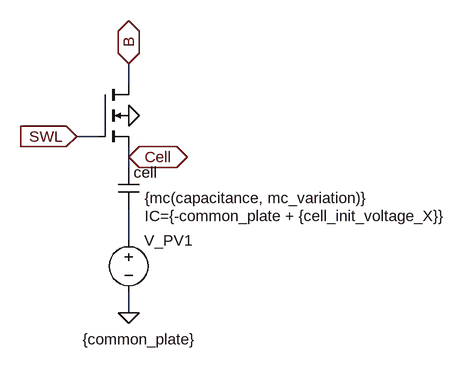
[diagram p0: schematic dram_cell.asc]
dram_cell.asc, the LTspice schematic file:
Version 4
SHEET 1 9124 2520
WIRE 624 -1360 624 -1392
WIRE 576 -1280 544 -1280
WIRE 624 -1248 624 -1264
WIRE 624 -1232 624 -1248
WIRE 624 -1120 624 -1168
WIRE 624 -1008 624 -1040
FLAG 624 -1248 Cell
IOPIN 624 -1248 BiDir
FLAG 544 -1280 SWL
IOPIN 544 -1280 In
FLAG 624 -1392 B
IOPIN 624 -1392 BiDir
FLAG 624 -1008 0
FLAG 624 -1312 0
SYMBOL nmos4 576 -1360 R0
WINDOW 0 104 24 Invisible 2
WINDOW 3 179 41 Invisible 2
SYMATTR InstName M7
SYMATTR Value nmoslp
SYMATTR Value2 l={mc(access_tran_L,mc_variation)} w={mc(access_tran_W,mc_variation)}
SYMBOL cap 608 -1232 R0
WINDOW 3 41 47 Left 2
WINDOW 39 41 75 Left 2
SYMATTR Value {mc(capacitance, mc_variation)}
SYMATTR SpiceLine IC={-common_plate + {cell_init_voltage_X}}
SYMATTR InstName cell
SYMBOL voltage 624 -1136 R0
WINDOW 123 0 0 Left 2
WINDOW 39 -71 197 Left 2
WINDOW 3 -71 169 Left 2
SYMATTR Value {common_plate}
SYMATTR InstName V_PV1

The netlist it stands for:
* dram_cell.asc
M7 B SWL Cell 0 nmoslp l={mc(access_tran_L,mc_variation)} w={mc(access_tran_W,mc_variation)}
cell Cell N001 {mc(capacitance, mc_variation)} IC={-common_plate + {cell_init_voltage_X}}
V_PV1 N001 0 {common_plate}
.model NMOS NMOS
.model PMOS PMOS
.lib standard.mos
.backanno
.end